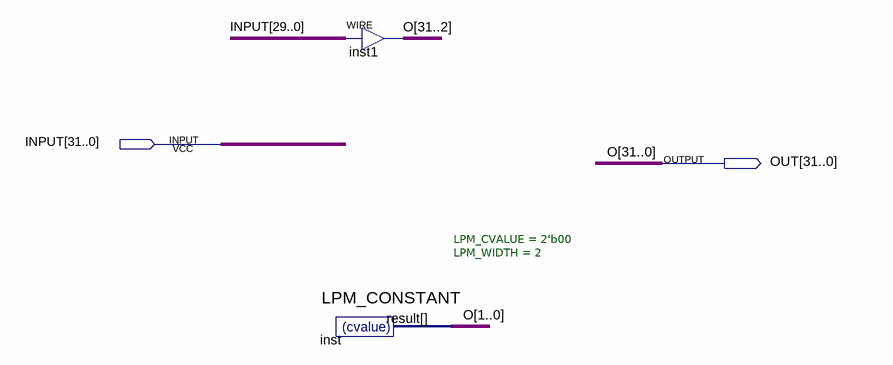
[diagram p0: schematic sheet]
// Quartus schematic leftshift.bdf as structural Verilog: 2 symbols, 2 pins
module leftshift (
  input  [31:0] INPUT,
  output [31:0] OUT
);

  assign OUT[31:2] = INPUT[29:0];  // WIRE inst1
  LPM_CONSTANT #(.LPM_CVALUE(2'b00), .LPM_WIDTH(2)) inst (.result(OUT[1:0]));

  // Other names for the same wires on the sheet: O[31:0] = OUT
endmodule
